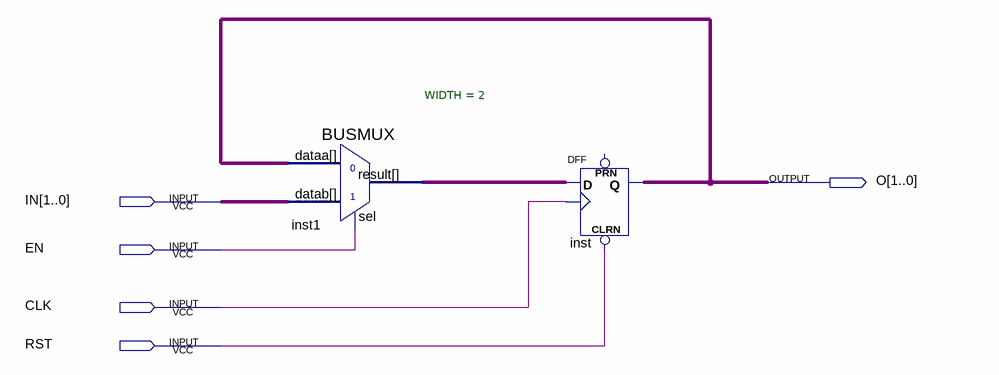
[diagram p0: schematic sheet]
// Quartus schematic REGISTER2BIT.bdf as structural Verilog: 2 symbols, 5 pins
module REGISTER2BIT (
  input  [1:0] IN,
  input  EN,
  input  CLK,
  input  RST,
  output [1:0] O
);

  wire [1:0] inst1_result;

  BUSMUX #(.WIDTH(2)) inst1 (.datab(IN), .sel(EN), .dataa(O), .result(inst1_result));
  DFF inst[1:0] (.CLRN(RST), .CLK(CLK), .D(inst1_result), .Q(O));  // open: PRN
endmodule
